# EAGLE design bikealarmf (EAGLE 9.2.2)
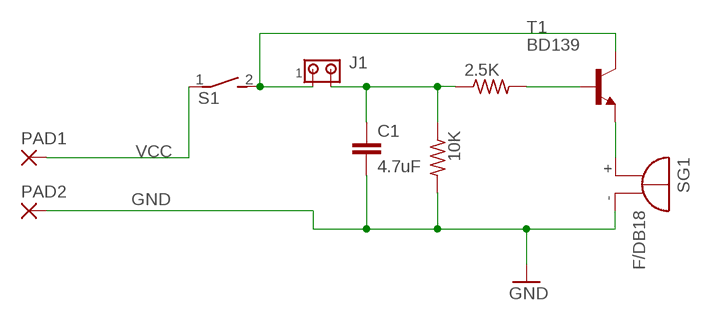
[diagram p0: schematic, sheet 1]

## Parts
2.5K  R-US_0204/7  [0204/7]
10K  R-US_0204/7  [0204/7]
C1  4.7uF  C-EU025-030X050  [C025-030X050]
J1  MTA02-156  [1X2MTA]
PAD1  2,15/1,0  [2,15/1,0]
PAD2  2,15/1,0  [2,15/1,0]
S1  DS01E  [DS-01]
SG1  F/DB18  [F/DB18]
T1  BD139  [TO126]

## Nets
GND: 10K.2 C1.2 J1.1 PAD2.1(P) S1.2 SG1.- T1.2(C)
N$1: SG1.+ T1.1(E)
N$2: 2.5K.2 T1.3(B)
N$3: 2.5K.1 10K.1 C1.1 J1.2
VCC: PAD1.1(P) S1.1

## Library data of the parts
2.5K 10K = rcl:R-US_: RESISTOR, American symbol; SPICEPREFIX: R
C1 = rcl:C-EU: CAPACITOR, European symbol; SPICEPREFIX: C
J1 = con-amp:MTA02-156: AMP connector
PAD1 PAD2 = wirepad:2,15/1,0: THROUGH-HOLE PAD
S1 = switch-dil:DS01E: DIL/CODE SWITCH; OC_FARNELL: unknown; OC_NEWARK: unknown
SG1 = buzzer:F/DB18: BUZZER Source: Buerklin; OC_FARNELL: unknown; OC_NEWARK: unknown
T1 = transistor:BD139: NPN TRANSISTOR

## Board
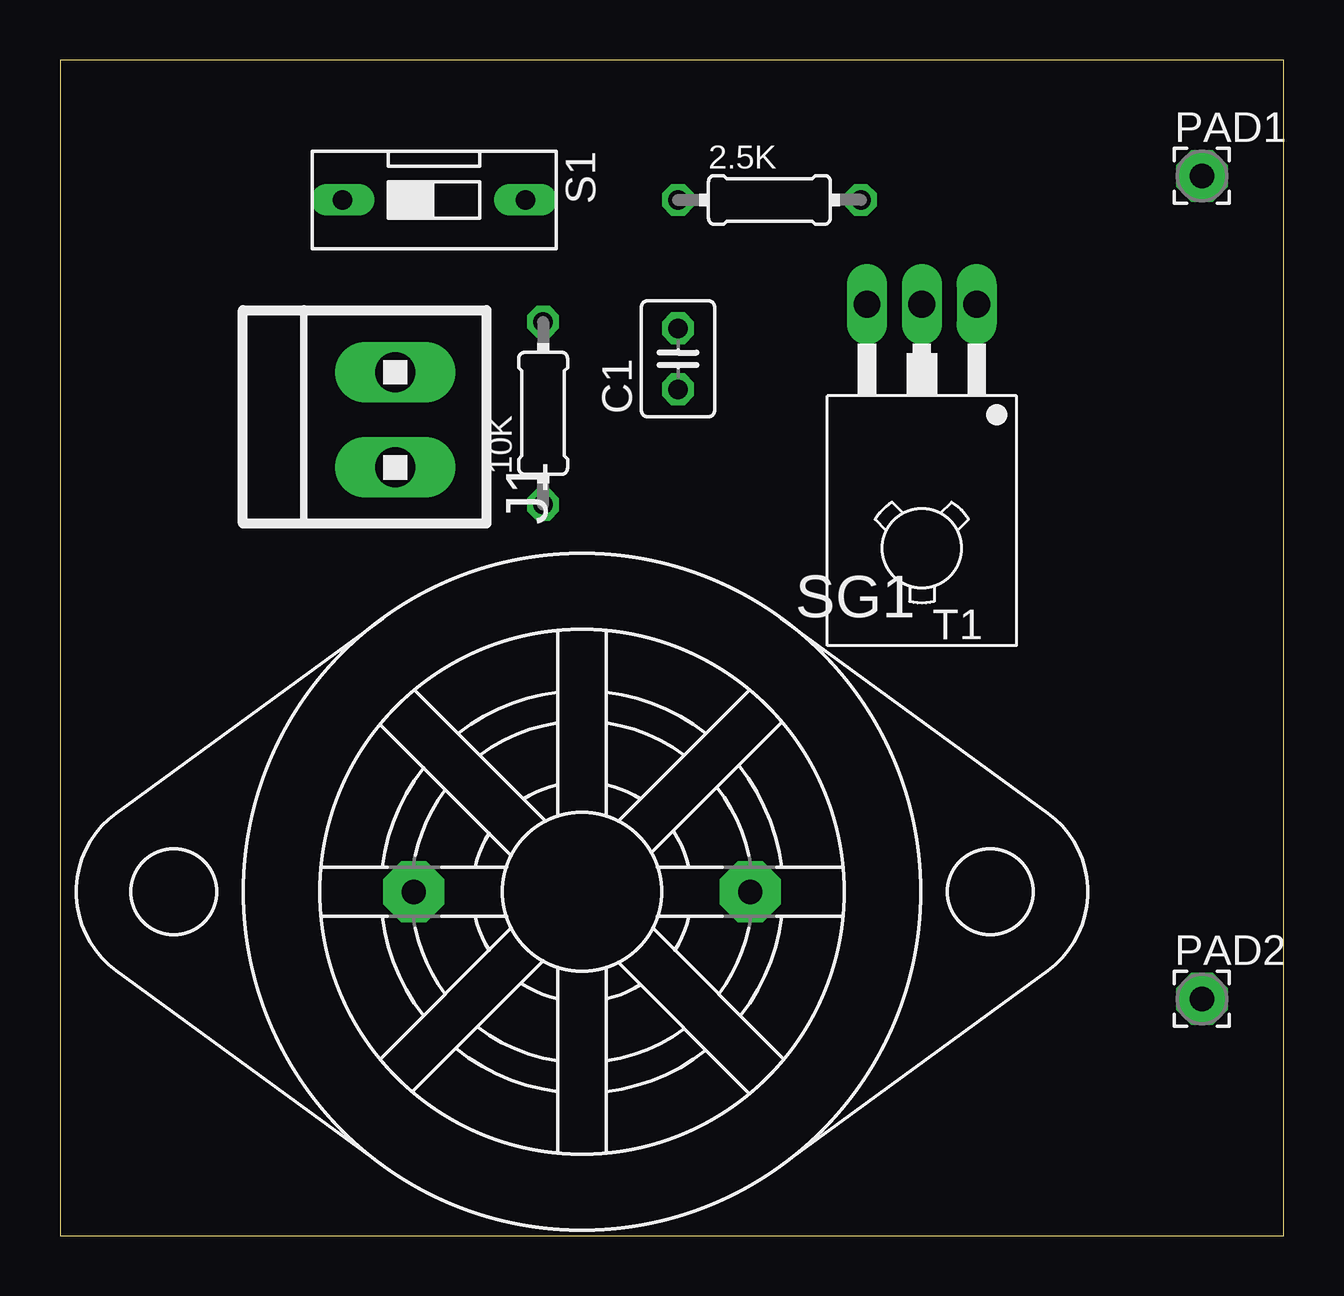
[diagram p1: board, top side]
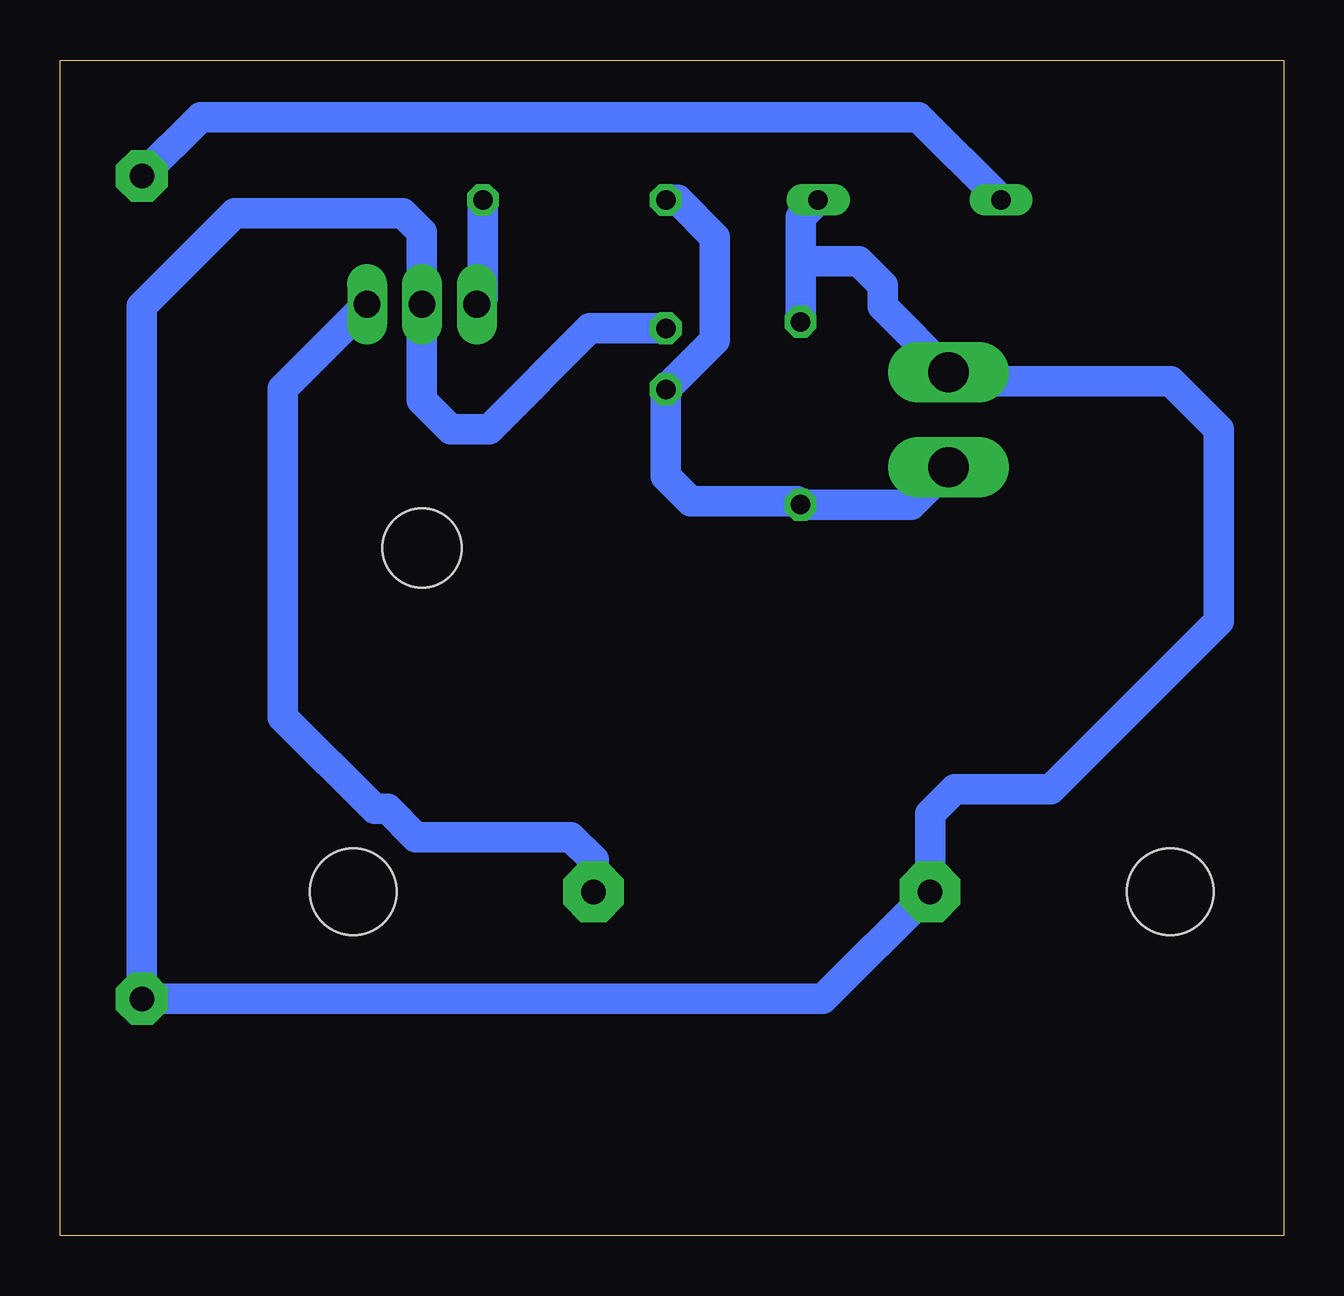
[diagram p2: board, bottom side, seen from below]

Size 50.99 x 48.98 mm. Coordinates in mm from the lower left corner, seen from the top.
Outline: 0,0 50.99,0 50.99,48.98 0,48.98 0,0
Copper layers (1*16): Top 0.035mm / dielectric 1.5mm / Bottom 0.035mm
Design rules "default": minimum track width 6mil, minimum drill 0.35mm, track to track 6mil, track to pad 6mil, pad to pad 6mil, via to via 6mil, smd to smd 6mil, copper to edge 40mil, drill to drill 6mil, minimum pad ring 10mil, minimum via ring 8mil, stop-mask expansion 4mil, vias tented up to drill 0mil, thermal gap 10mil

### Footprints (pad centres in the part's own frame; a part is rotated, then mirrored left to right if it is on the bottom)
0204/7 = drill 0.813 octagon: 1 -3.81,0; 2 3.81,0
C025-030X050 = drill 0.813 octagon: 1 -1.27,0; 2 1.27,0
1X2MTA = drill 1.676 long: 1 1.981,0; 2 -1.981,0
2,15/1,0 = drill 1.016 pad 2.159 octagon: 1 0,0
DS-01 = drill 0.813 long: 1 0,-3.81; 2 0,3.81
F/DB18 = drill 1.016 pad 2.54 octagon: + 7.01,0; - -7.01,0 | hole 3.607: 17.018,0; -17.018,0
TO126 = drill 1.118 long: 1 -2.286,-5.08; 2 0,-5.08; 3 2.286,-5.08 | hole 3.302: 0,5.08

### Placement (x,y rotation side)
2.5K  29.56,43.15 0 top
10K  20.13,34.26 90 top
C1  25.75,36.53 90 top
J1  13.97,33.99 90 top
PAD1  47.58,44.15 0 top
PAD2  47.58,9.86 0 top
S1  15.59,43.15 270 top
SG1  21.75,14.32 0 top
T1  35.91,33.72 180 top

### Tracks (layer width: path | path; a pad name or v marks a point on that pad's centre or on a via)
GND
  Bottom 1.27: S1.2 20.13,42.42 20.13,40.6 | 20.13,40.6 10K.2 | C1.2 28.91,37.8 33.11,33.6 34.71,33.6 35.91,34.8 T1.2 35.91,41.8 36.71,42.6 43.71,42.6 47.58,38.73 PAD2.1 19.2,9.86 SG1.- 14.74,17.57 13.71,18.6 9.71,18.6 2.71,25.6 2.71,33.6 4.71,35.6 13.6,35.6 J1.1 16.71,38.71 16.71,39.6 17.71,40.6 20.13,40.6
N$1
  Bottom 1.27: T1.1 41.71,35.29 41.71,21.6 37.88,17.77 37.34,17.77 36.16,16.6 29.71,16.6 28.76,15.65 SG1.+
N$2
  Bottom 1.27: 2.5K.2 33.37,39.05 T1.3
N$3
  Bottom 1.27: J1.2 15.53,30.45 10K.1 20.28,30.6 24.71,30.6 25.75,31.64 C1.1 23.71,37.3 23.71,41.6 25.26,43.15 2.5K.1
VCC
  Bottom 1.27: S1.1 15.23,46.6 45.13,46.6 PAD1.1